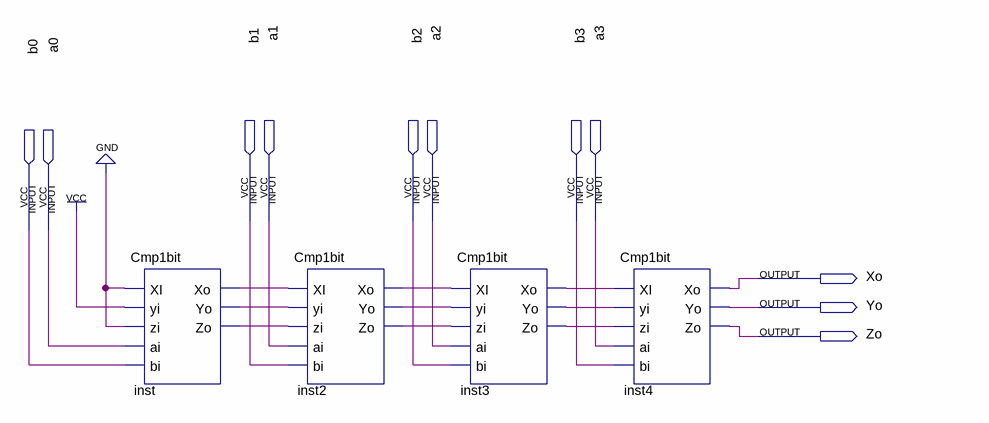
[diagram p0: schematic sheet]
// Quartus schematic Cmp4bit.bdf as structural Verilog: 4 symbols, 11 pins
module Cmp4bit (
  input  b1,
  input  a1,
  input  b2,
  input  a2,
  input  b3,
  input  a3,
  input  b0,
  input  a0,
  output Xo,
  output Yo,
  output Zo
);

  wire inst2_xo, inst2_yo, inst2_zo, inst3_xo, inst3_yo, inst3_zo, inst_xo, inst_yo, inst_zo;

  Cmp1bit inst (.XI(1'b0), .yi(1'b1), .zi(1'b0), .ai(a0), .bi(b0), .Xo(inst_xo), .Yo(inst_yo), .Zo(inst_zo));
  Cmp1bit inst2 (
    .XI(inst_xo), .yi(inst_yo), .zi(inst_zo), .ai(a1), .bi(b1), .Xo(inst2_xo), .Yo(inst2_yo), .Zo(inst2_zo));
  Cmp1bit inst3 (
    .XI(inst2_xo), .yi(inst2_yo), .zi(inst2_zo), .ai(a2), .bi(b2), .Xo(inst3_xo), .Yo(inst3_yo), .Zo(inst3_zo));
  Cmp1bit inst4 (.XI(inst3_xo), .yi(inst3_yo), .zi(inst3_zo), .ai(a3), .bi(b3), .Xo(Xo), .Yo(Yo), .Zo(Zo));
endmodule
